# EAGLE design al_DozeDot (EAGLE 9.6.2)
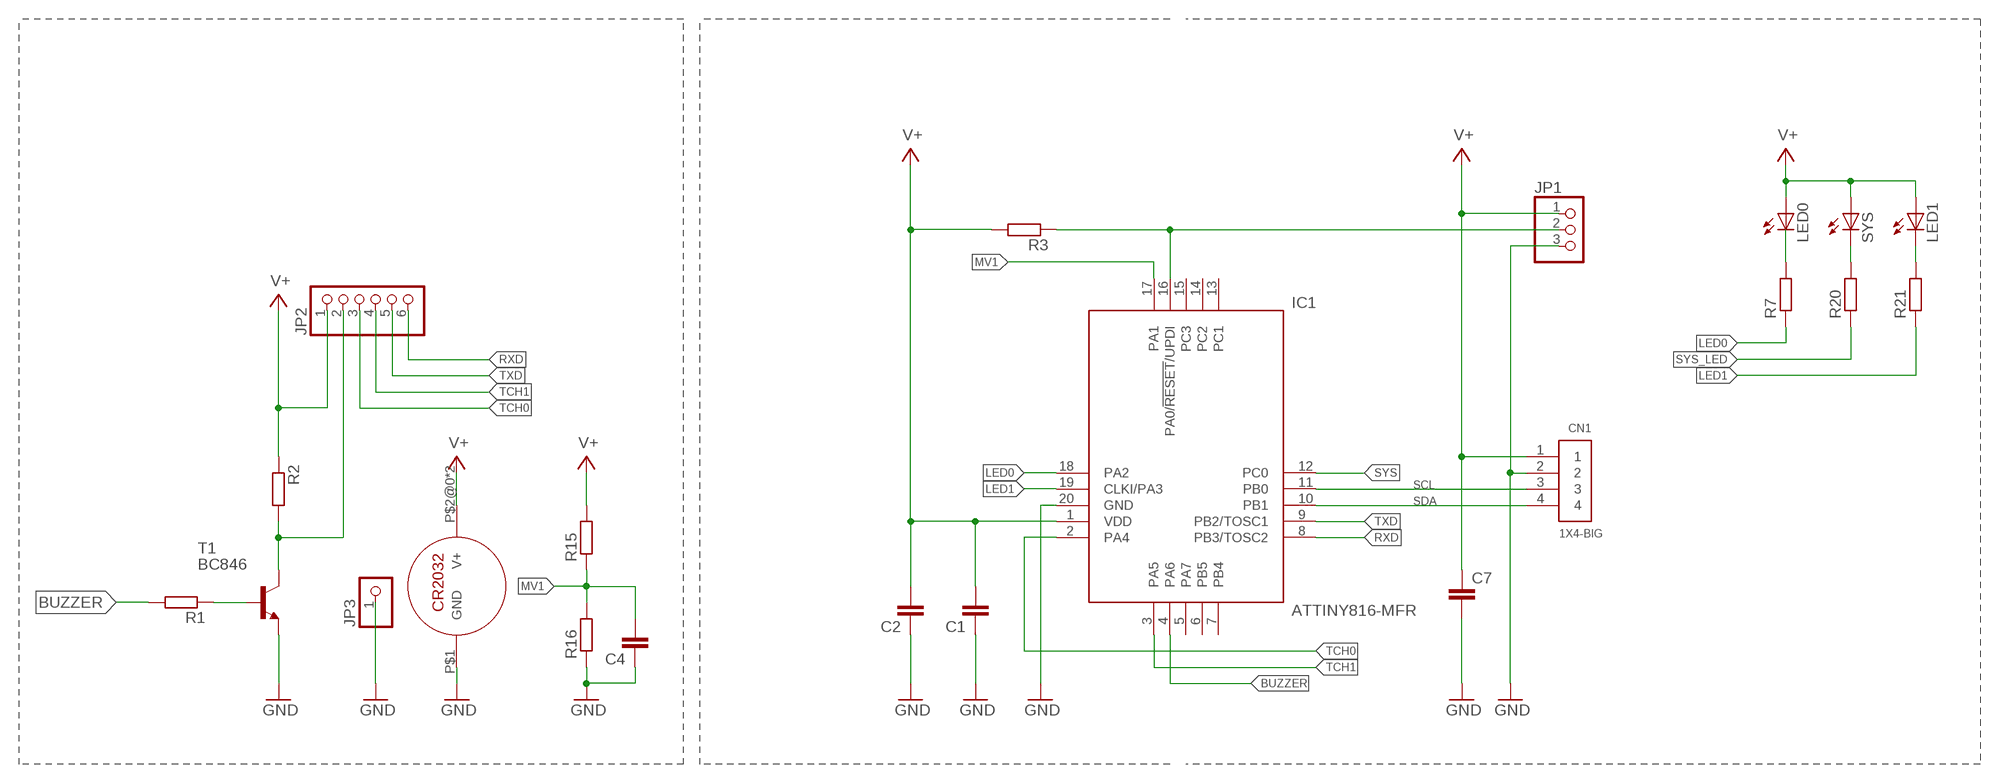
[diagram p0: schematic, sheet 1]

## Parts
C1  C-EUC0603  [C0603]
C2  C-EUC0603  [C0603]
C4  C-EUC0603  [C0603]
C7  C-EUC0603K  [C0603K]
CN1  1X4-BIG  [1X04-BIG]
IC1  ATTINY816-MFR  [SOIC127P1030X265-20N]
JP1  PINHD-1X3  [1X03]
JP2  PINHD-1X6  [1X06]
JP3  PINHD-1X1  [1X01]
LED0  LED_ESML0603  [LED_SML0603]
LED1  LED_ESML0603  [LED_SML0603]
R1  RR0603  [R0603]
R2  RR0603  [R0603]
R3  R-EU_R0603  [R0603]
R7  R-EU_R0603  [R0603]
R15  R-EU_R0603  [R0603]
R16  R-EU_R0603  [R0603]
R20  R-EU_R0603  [R0603]
R21  R-EU_R0603  [R0603]
SYS  LED_ESML0603  [LED_SML0603]
T1  BC846  [SOT23]
U$2  CR2032  [DS1092-07-W6L]

## Nets
BUZZER: IC1.4(PA6) R1.2
GND: C1.1 C2.1 C4.1 C7.2 CN1.2 IC1.20(GND) JP1.3 JP3.1 R16.1 T1.2(E) U$2.P$1(GND)
LED0: IC1.18(PA2) R7.1
LED1: IC1.19(CLKI/PA3) R21.1
MV1: C4.2 IC1.17(PA1) R15.1 R16.2
N$1: R1.1 T1.1(B)
N$2: JP2.2 R2.2 T1.3(C)
N$3: IC1.16(PA0/!RESET!/UPDI) JP1.2 R3.1
N$5: LED0.C R7.2
N$24: LED1.C R21.2
N$25: R20.2 SYS.C
RXD: IC1.8(PB3/TOSC2) JP2.6
SCL: CN1.3 IC1.11(PB0)
SDA: CN1.4 IC1.10(PB1)
SYS: IC1.12(PC0)
SYS_LED: R20.1
TCH0: IC1.2(PA4) JP2.3
TCH1: IC1.3(PA5) JP2.4
TXD: IC1.9(PB2/TOSC1) JP2.5
V+: C1.2 C2.2 C7.1 CN1.1 IC1.1(VDD) JP1.1 JP2.1 LED0.A LED1.A R2.1 R3.2 R15.2 SYS.A U$2.P$2@0(V+) U$2.P$2@1(V+)
Unconnected: IC1.5(PA7) IC1.6(PB5) IC1.7(PB4) IC1.13(PC1) IC1.14(PC2) IC1.15(PC3)

## Library data of the parts
C1 C2 C4 = resistor:C-EU: CAPACITOR, European symbol
C7 = rcl:C-EU: CAPACITOR, European symbol
CN1 = adafruit:1X4: 4-pin connector
IC1 = ATTINY816-SFR:ATTINY816-MFR: 8-bit Microcontrollers - MCU AVR 8-bit Microcontroller <https://componentsearchengine.com/Images/9/ATTINY816-MFR.jpg> Source: Datasheet <http://www.mouser.com/ds/2/268/Atmel-42721C-AVR-ATtiny417-814-816-817-Datasheet_C-1108114.pdf>
JP1 = adafruit:PINHD-1X3: PIN HEADER
JP2 = adafruit:PINHD-1X6: PIN HEADER
JP3 = adafruit:PINHD-1X1: Pin header 1x1 for 0.1" spacing With round pins
LED0 LED1 SYS = eagle-ltspice:LED_E: LED Source: http://www.osram.convergy.de Source: www.luxeon.com Source: www.kingbright.com; SPICEMODEL: NONE; SPICEPREFIX: D; SPICETYPE: diode
R1 R2 = eagle-ltspice:R: RESISTOR, European symbol; SPICEMODEL: NONE; SPICEPREFIX: R
R3 R7 R15 R16 R20 R21 = rcl:R-EU_: RESISTOR, European symbol
T1 = transistor:BC846: NPN TRANSISTOR
U$2 = cr2032:CR2032

## Net classes
0 default: clearance 0.205 mm

## Board
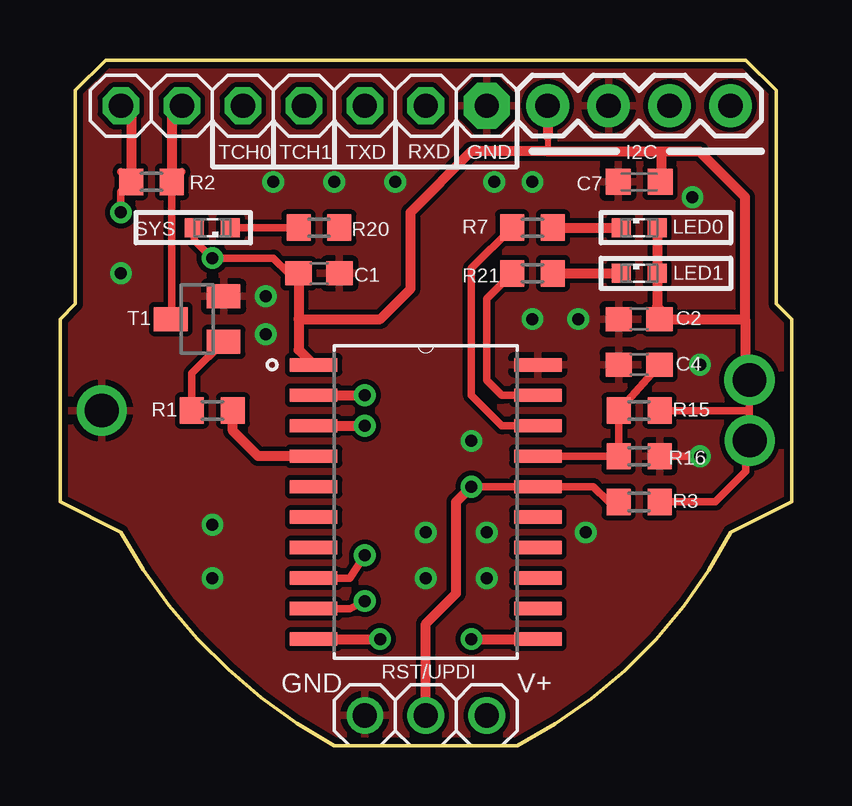
[diagram p1: board, top side]
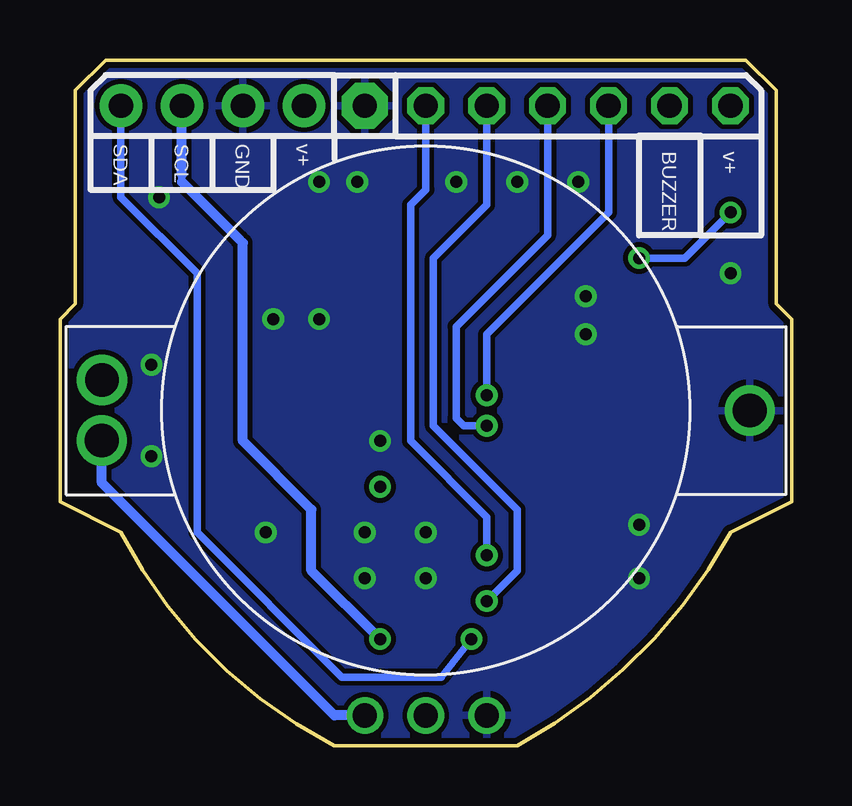
[diagram p2: board, bottom side, seen from below]

Size 30.48 x 28.57 mm. Coordinates in mm from the lower left corner, seen from the top.
Outline: 0.63,27.3 1.9,28.57 28.57,28.57 29.84,27.3 29.84,18.41 30.48,17.78 30.48,10.16 27.94,8.89 arc-35 19.05,0 11.43,0 arc-33 2.54,8.89 0,10.16 0,17.78 0.63,18.41 0.63,27.3
Copper layers (1*16): Top 0.035mm / dielectric 1.5mm / Bottom 0.035mm
Design rules "default *": minimum track width 8mil, minimum drill 0.35mm, track to track 8mil, track to pad 8mil, pad to pad 8mil, via to via 8mil, smd to smd 8mil, copper to edge 10mil, drill to drill 8mil, minimum pad ring 10mil, minimum via ring 8mil, stop-mask expansion 2mil, vias tented up to drill 20mil, thermal gap 10mil

### Footprints (pad centres in the part's own frame; a part is rotated, then mirrored left to right if it is on the bottom)
C0603 = smd 1.1 x 1: 1 -0.85,0; 2 0.85,0
C0603K = smd 1.05 x 1.08: 1 -0.875,0; 2 0.875,0
1X04-BIG = drill 1.016 pad 1.778: 1 0,0; 2 2.54,0; 3 5.08,0; 4 7.62,0
SOIC127P1030X265-20N = smd 1.981 x 0.559: 1 -4.674,5.715; 2 -4.674,4.445; 3 -4.674,3.175; 4 -4.674,1.905; 5 -4.674,0.635; 6 -4.674,-0.635; 7 -4.674,-1.905; 8 -4.674,-3.175; 9 -4.674,-4.445; 10 -4.674,-5.715; 11 4.674,-5.715; 12 4.674,-4.445; 13 4.674,-3.175; 14 4.674,-1.905; 15 4.674,-0.635; 16 4.674,0.635; 17 4.674,1.905; 18 4.674,3.175; 19 4.674,4.445; 20 4.674,5.715
1X03 = drill 1.016: 1 -2.54,0; 2 0,0; 3 2.54,0
1X06 = drill 1.016 octagon: 1 -6.35,0; 2 -3.81,0; 3 -1.27,0; 4 1.27,0; 5 3.81,0; 6 6.35,0
1X01 = drill 1.016 pad 1.93 octagon: 1 0,0
LED_SML0603 = smd 0.8 x 0.8: A 0.75,0; C -0.75,0
R0603 = smd 1 x 1.1: 1 -0.85,0; 2 0.85,0
SOT23 = smd 1 x 1.4: 1 -0.95,-1.1; 2 0.95,-1.1; 3 0,1.1
DS1092-07-W6L = drill 1.4: P$1 -13.5,0; P$2@0 13.5,1.245; P$2@1 13.487,-1.27

### Placement (x,y rotation side)
C1  10.79,19.69 180 top
C2  24.13,17.78 0 top
C4  24.13,15.88 0 top
C7  24.13,23.49 180 top
CN1  20.32,26.67 0 top
IC1  15.24,10.16 0 top
JP1  15.24,1.27 180 top
JP2  8.89,26.67 0 top
JP3  17.78,26.67 0 top
LED0  24.13,21.59 0 top
LED1  24.13,19.69 0 top
R1  6.35,13.97 0 top
R2  3.81,23.49 0 top
R3  24.13,10.16 0 top
R7  19.68,21.59 0 top
R15  24.13,13.97 0 top
R16  24.13,12.06 180 top
R20  10.79,21.59 180 top
R21  19.68,19.69 0 top
SYS  6.35,21.59 180 top
T1  5.71,17.78 90 top
U$2  15.24,13.97 180 bottom

### Tracks (layer width: path | path; a pad name or v marks a point on that pad's centre or on a via)
BUZZER
  Top 0.406: IC1.4 8.26,12.06 7.2,13.12 R1.2
GND  (via drill 0.5)
  Top 0.305: v26.67,12.06 R16.1
  other vias: 19.68,17.78 21.59,17.78 6.35,6.99 15.24,6.99 2.54,19.69 21.91,8.89 17.78,6.99 17.78,8.89 19.68,23.49 26.35,22.86 8.57,18.73 6.35,9.21 15.24,8.89 18.1,23.49 11.43,23.49 13.97,23.49 8.89,23.49 26.67,15.88 17.14,12.7 8.57,17.15
  pour Top: -2.54,29.21 33.02,29.21 33.02,-1.27 -2.54,-1.27
  pour Bottom: -2.54,29.21 33.02,29.21 33.02,-1.27 -2.54,-1.27
LED0
  Top 0.305: IC1.18 18.41,13.33 17.14,14.6 17.14,19.9 R7.1
LED1
  Top 0.305: IC1.19 18.41,14.6 17.78,15.24 17.78,18.63 R21.1
MV1
  Top 0.305: IC1.17 R16.2 R15.1 C4.2
N$1
  Top 0.305: T1.1 5.5,15.51 R1.1
N$2
  Top 0.305: T1.3 4.66,17.83 R2.2 5.08,23.91
  Top 0.406: JP2.2 4.66,26.25 R2.2
N$3  (via drill 0.5)
  Top 0.305: v17.14,10.79 IC1.16 22.23,10.79 22.86,10.16 R3.1
  Top 0.406: JP1.2 15.24,5.08 16.51,6.35 16.51,10.16 v17.14,10.79
N$5
  Top 0.406: R7.2 LED0.C
N$24
  Top 0.406: R21.2 LED1.C
N$25
  Top 0.305: SYS.C R20.2
RXD  (via drill 0.5)
  Top 0.305: IC1.8 12.06,6.99 v12.7,7.94
  Bottom 0.305: v12.7,7.94 12.7,9.53 15.87,12.7 15.87,22.54 15.24,23.18 JP2.6
SCL  (via drill 0.5)
  Top 0.406: v17.14,4.45 IC1.11
  Bottom 0.305: 23.02,21.11 22.86,20.95 | 25.4,23.49 25.4,23.81
  Bottom 0.406: v17.14,4.45 20,7.3 20,9.84 22.86,12.7 22.86,20.95 | 25.4,23.49 23.02,21.11 | 25.4,23.81 CN1.3
SDA  (via drill 0.5)
  Top 0.406: IC1.10 v13.33,4.45
  Bottom 0.305: v13.33,4.45 14.6,2.86 18.73,2.86 24.77,8.89 24.77,19.69 27.94,22.86 CN1.4
TCH0  (via drill 0.5)
  Top 0.406: IC1.2 v12.7,14.6
  Bottom 0.305: v12.7,14.6 12.7,17.15 7.62,22.23 JP2.3
TCH1  (via drill 0.5)
  Top 0.406: IC1.3 v12.7,13.33
  Bottom 0.305: v12.7,13.33 13.65,13.33 13.97,13.65 13.97,17.46 10.16,21.27 JP2.4
TXD  (via drill 0.5)
  Top 0.305: IC1.9 12.06,5.71 v12.7,6.03
  Bottom 0.305: v12.7,6.03 11.43,7.3 11.43,9.84 14.92,13.33 14.92,20.32 12.7,22.54 JP2.5
V+  (via drill 0.5)
  Top 0.254: 20.32,25.4 20.32,24.77
  Top 0.305: 28.73,13.97 28.73,12.74 U$2.P$2@0 28.73,12.71 | 28.73,13.97 U$2.P$2@1 28.73,12.71 | R3.2 27.3,10.16 28.57,11.43 28.57,12.56 28.73,12.71 | R15.2 28.73,13.97 | SYS.A 5.6,21.07 v6.35,20.32 8.89,20.32 9.53,19.69 C1.2 | 2.54,23.91 R2.1 2.54,23.08 v2.54,22.23 | JP2.1 2.96,26.25
  Top 0.406: 28.57,15.24 U$2.P$2@1 28.55,15.42 28.55,17.78 | 28.55,17.78 28.55,22.86 26.64,24.77 25.08,24.77 | 25.08,24.77 20.32,24.77 17.14,24.77 14.6,22.23 14.6,19.05 13.33,17.78 9.94,17.78 | CN1.1 20.32,25.4 | 25.4,17.78 C2.2 | 25.4,17.78 28.55,17.78 | LED0.A LED1.A 24.88,18.3 25.4,17.78 | C1.2 9.94,17.78 | 9.94,17.78 9.94,16.5 IC1.1 | C7.1 25.08,23.57 25.08,24.77 | 2.96,26.25 R2.1
  Bottom 0.305: v2.54,22.23 4.44,20.32 v6.35,20.32
  Bottom 0.406: JP1.1 19.05,1.27 28.74,10.96 U$2.P$2@0

### Text on the board
tPlace: TCH0 | TCH1 | TXD | RXD | GND | I2C | GND | RST/UPDI | V+
bPlace: v+ | BUZZER | v+ | GND | SCL | SDA